# Altium schematic sheet POWER.SchDoc
size A4; SheetNumber: 6; SheetTotal: 6
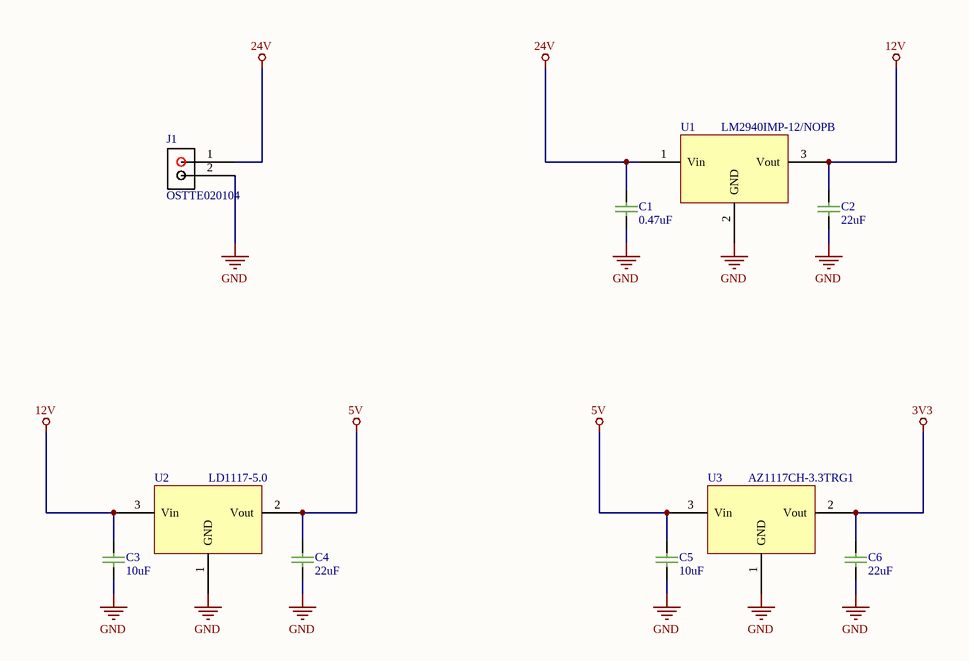
[diagram p0: POWER.SchDoc]

## Parts
C1  0.47uF  [CAP-1206]
C2  22uF  [CAP-1206]
C3  10uF  [CAP-1206]
C4  22uF  [CAP-1206]
C5  10uF  [CAP-1206]
C6  22uF  [CAP-1206]
J1  OSTTE020104  [TERMBLK-P3.5-SIDEENT]
U1  LM2940IMP-12/NOPB  [SOT-223]
U2  LD1117-5.0  [SOT-223]
U3  AZ1117CH-3.3TRG1  [SOT-223]

## Nets
3V3: C6.2 U3.2(Vout)
5V: C4.2 C5.2 U2.2(Vout) U3.3(Vin)
12V: C2.2 C3.2 U1.3(Vout) U2.3(Vin)
24V: C1.2 J1.1 U1.1(Vin)
GND: C1.1 C2.1 C3.1 C4.1 C5.1 C6.1 J1.2 U1.2(GND) U2.1(GND) U3.1(GND)

## Library data of the parts
C1 = CAP-1206: CAP CER 0.47UF 50V X7R 1206
C2 = CAP-1206: CAP CER 22UF 25V X5R 1206
C3 = CAP-1206: CAP CER 10UF 25V X5R 1206
C4 = CAP-1206: CAP CER 22UF 16V X5R 1206
C5 = CAP-1206: CAP CER 10UF 16V X5R 1206
C6 = CAP-1206: CAP CER 22UF 10V X5R 1206
J1 = OSTTE020104: TERM BLK 2POS SIDE ENT 3.5MM PCB
U1 = LM2940IMP-12/NOPB: IC REG LINEAR 12V 1A SOT-223-4
U2 = LD1117-5.0: IC REG LINEAR 5V 1A SOT-223-3L
U3 = AZ1117CH-3.3TRG1: IC REG LINEAR 3.3V 1A SOT-223-3